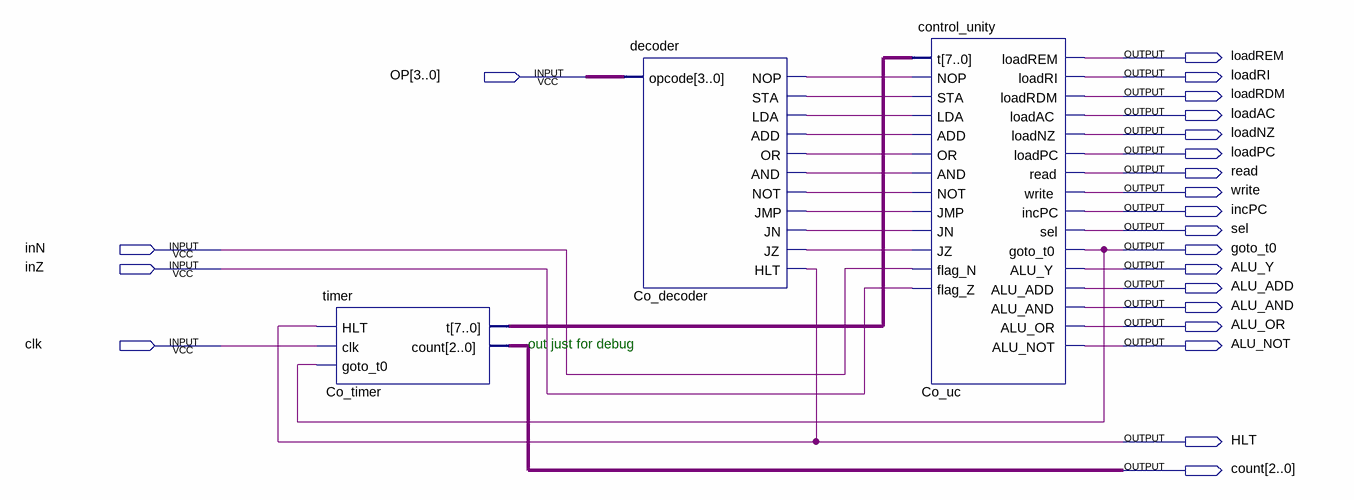
[diagram p0: schematic sheet]
// Quartus schematic lab07.bdf as structural Verilog: 3 symbols, 22 pins
module lab07 (
  input  [3:0] OP,
  input  inN,
  input  inZ,
  input  clk,
  output loadREM,
  output loadRI,
  output loadRDM,
  output loadAC,
  output loadNZ,
  output loadPC,
  output read,
  output write,
  output incPC,
  output sel,
  output goto_t0,
  output ALU_Y,
  output ALU_ADD,
  output ALU_AND,
  output ALU_OR,
  output ALU_NOT,
  output HLT,
  output [2:0] count
);

  wire Co_decoder_add, Co_decoder_and, Co_decoder_jmp, Co_decoder_jn, Co_decoder_jz, Co_decoder_lda,
       Co_decoder_nop, Co_decoder_not, Co_decoder_or, Co_decoder_sta;
  wire [7:0] Co_timer_t;

  timer Co_timer (.HLT(HLT), .clk(clk), .goto_t0(goto_t0), .t(Co_timer_t), .count(count));
  decoder Co_decoder (
    .opcode(OP), .NOP(Co_decoder_nop), .STA(Co_decoder_sta), .LDA(Co_decoder_lda), .ADD(Co_decoder_add),
    .OR(Co_decoder_or), .AND(Co_decoder_and), .NOT(Co_decoder_not), .JMP(Co_decoder_jmp), .JN(Co_decoder_jn),
    .JZ(Co_decoder_jz), .HLT(HLT));
  control_unity Co_uc (
    .t(Co_timer_t), .NOP(Co_decoder_nop), .STA(Co_decoder_sta), .LDA(Co_decoder_lda), .ADD(Co_decoder_add),
    .OR(Co_decoder_or), .AND(Co_decoder_and), .NOT(Co_decoder_not), .JMP(Co_decoder_jmp), .JN(Co_decoder_jn),
    .JZ(Co_decoder_jz), .flag_N(inN), .flag_Z(inZ), .loadREM(loadREM), .loadRI(loadRI), .loadRDM(loadRDM),
    .loadAC(loadAC), .loadNZ(loadNZ), .loadPC(loadPC), .read(read), .write(write), .incPC(incPC), .sel(sel),
    .goto_t0(goto_t0), .ALU_Y(ALU_Y), .ALU_ADD(ALU_ADD), .ALU_AND(ALU_AND), .ALU_OR(ALU_OR), .ALU_NOT(ALU_NOT));

  // Notes on the sheet:
  //   out just for debug
endmodule
